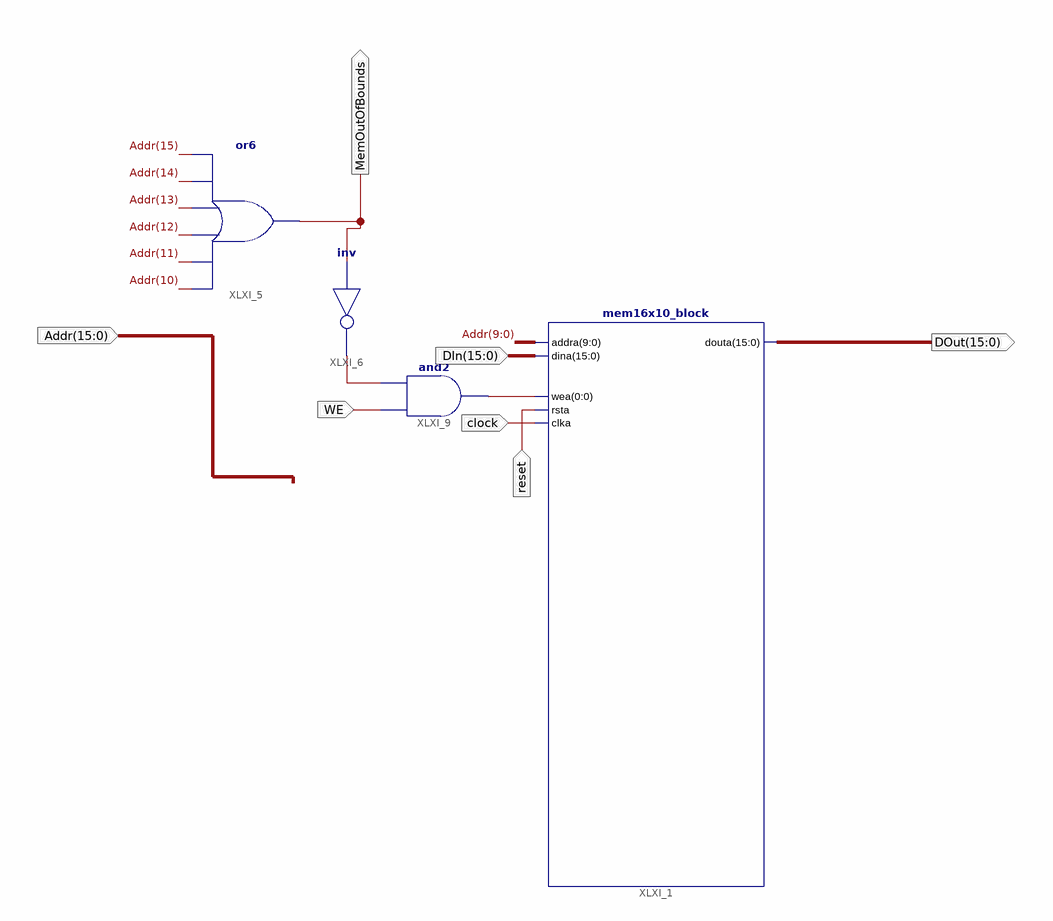
[diagram p0: schematic sheet 1]
// Xilinx ISE schematic Memory.sch (spartan3e) as structural Verilog: 4 symbols, 7 ports
module Memory (
  input  clock,
  input  [15:0] Addr,
  input  WE,
  input  reset,
  input  [15:0] DIn,
  output [15:0] DOut,
  output MemOutOfBounds
);

  wire XLXN_9;
  wire [0:0] XLXN_8;

  mem16x10_block XLXI_1 (.addra(Addr[9:0]), .dina(DIn), .wea(XLXN_8[0]), .rsta(reset), .clka(clock), .douta(DOut));
  or XLXI_5 (MemOutOfBounds, Addr[10], Addr[11], Addr[12], Addr[13], Addr[14], Addr[15]);
  not XLXI_6 (XLXN_9, MemOutOfBounds);
  and XLXI_9 (XLXN_8[0], WE, XLXN_9);
endmodule
